# Altium project IPA-Safety-Relay-Board.PrjPcb
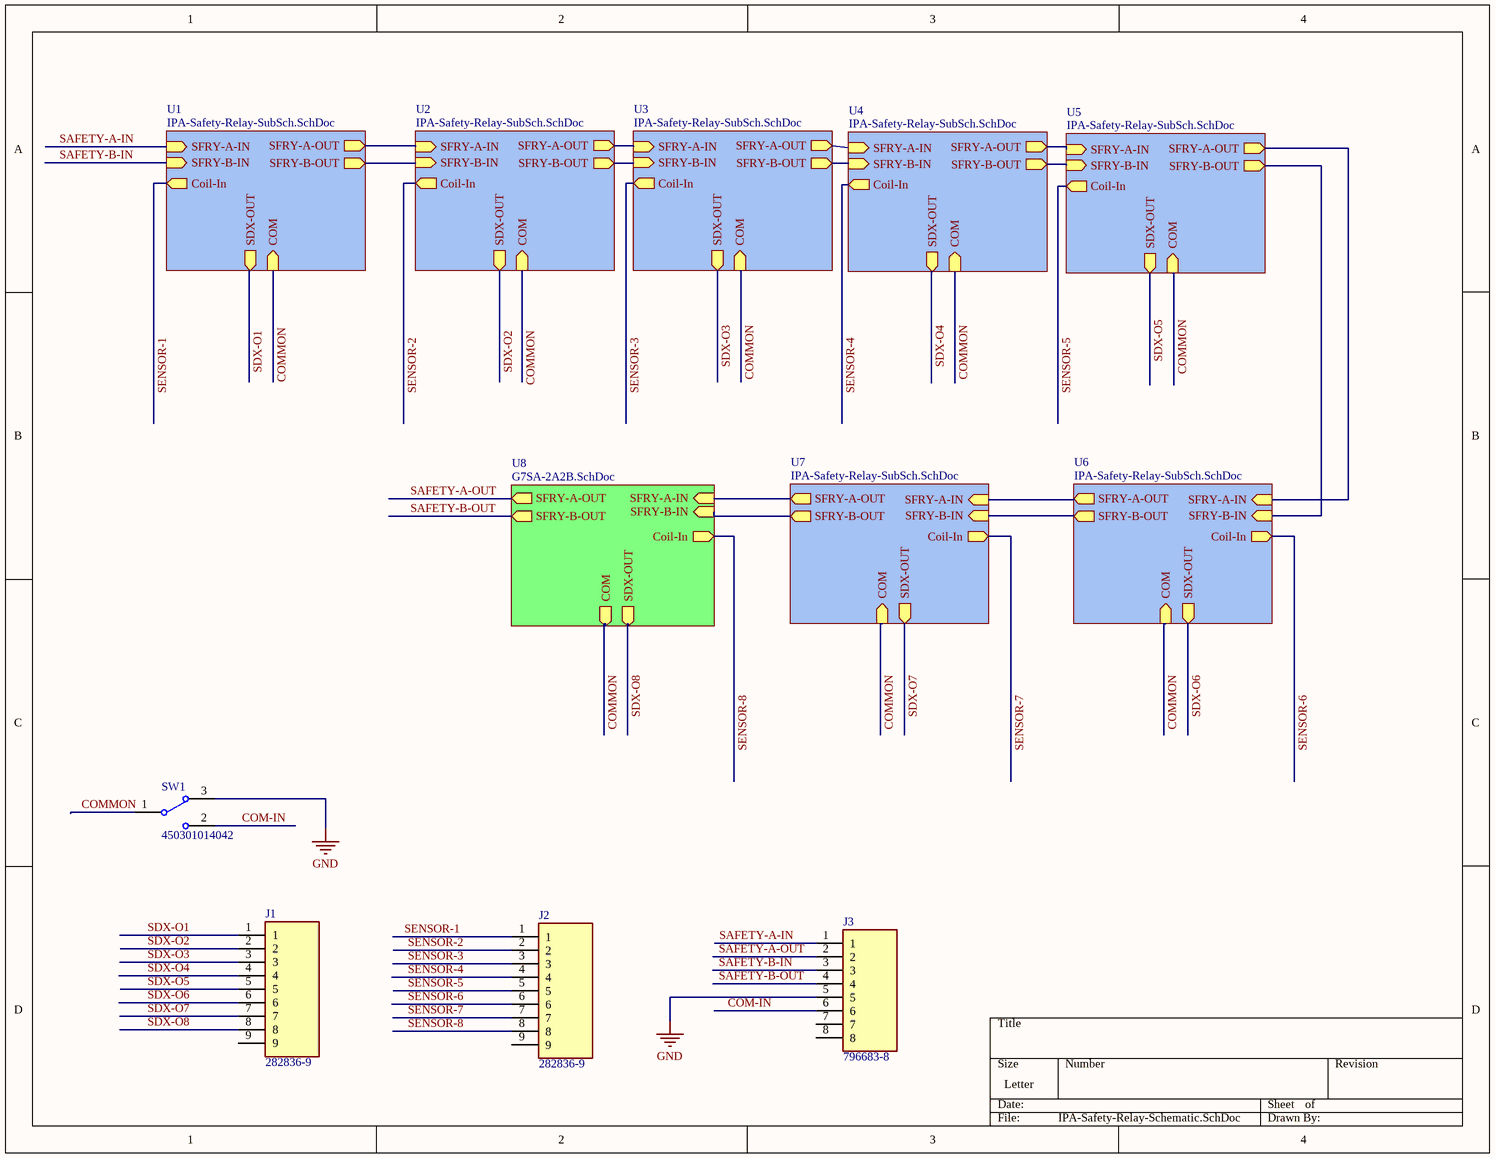
[diagram p0: IPA-Safety-Relay-Schematic.SchDoc]
3 sheets, 12 parts. Net scope: hierarchical (ports join the sheet entries above them; power ports are global).
Board file: IPA-Safety-Relay-PCB.PcbDoc
Sheets:
  IPA-Safety-Relay-Schematic.SchDoc
    U1 = IPA-Safety-Relay-SubSch.SchDoc
    U2 = IPA-Safety-Relay-SubSch.SchDoc
    U3 = IPA-Safety-Relay-SubSch.SchDoc
    U4 = IPA-Safety-Relay-SubSch.SchDoc
    U5 = IPA-Safety-Relay-SubSch.SchDoc
    U8 = G7SA-2A2B.SchDoc
    U6 = IPA-Safety-Relay-SubSch.SchDoc
    U7 = IPA-Safety-Relay-SubSch.SchDoc

## Sheet IPA-Safety-Relay-Schematic.SchDoc
size Letter

### Parts
J1  282836-9  [SHDR9W130P0X500_1X9_4500X820X1020P]
J2  282836-9  [SHDR9W130P0X500_1X9_4500X820X1020P]
J3  796683-8  [SHDR8W110P0X500_1X8_4000X900X1520P]
SW1  450301014042  [450301014042]

### Sub-sheets
U1 = IPA-Safety-Relay-SubSch.SchDoc: SFRY-A-IN (in), SFRY-B-IN (in), Coil-In (out), SFRY-A-OUT (out), SFRY-B-OUT (out), SDX-OUT (out), COM (in)
U2 = IPA-Safety-Relay-SubSch.SchDoc: SFRY-A-IN (in), SFRY-B-IN (in), Coil-In (out), SFRY-A-OUT (out), SFRY-B-OUT (out), SDX-OUT (out), COM (in)
U3 = IPA-Safety-Relay-SubSch.SchDoc: SFRY-A-IN (in), SFRY-B-IN (in), Coil-In (out), SFRY-A-OUT (out), SFRY-B-OUT (out), SDX-OUT (out), COM (in)
U4 = IPA-Safety-Relay-SubSch.SchDoc: SFRY-A-IN (in), SFRY-B-IN (in), Coil-In (out), SFRY-A-OUT (out), SFRY-B-OUT (out), SDX-OUT (out), COM (in)
U5 = IPA-Safety-Relay-SubSch.SchDoc: SFRY-A-IN (in), SFRY-B-IN (in), Coil-In (out), SFRY-A-OUT (out), SFRY-B-OUT (out), SDX-OUT (out), COM (in)
U6 = IPA-Safety-Relay-SubSch.SchDoc: SFRY-A-IN (in), SFRY-B-IN (in), Coil-In (out), SFRY-A-OUT (out), SFRY-B-OUT (out), SDX-OUT (out), COM (in)
U7 = IPA-Safety-Relay-SubSch.SchDoc: SFRY-A-IN (in), SFRY-B-IN (in), Coil-In (out), SFRY-A-OUT (out), SFRY-B-OUT (out), SDX-OUT (out), COM (in)
U8 = G7SA-2A2B.SchDoc: SFRY-B-IN (in), SFRY-B-OUT (out), SFRY-A-IN (in), SFRY-A-OUT (out), Coil-In (out), SDX-OUT (out), COM (out)

### Nets
GND: J3.5 SW1.3
COM-IN: J3.6 SW1.2
COMMON: SW1.1 ; sheet U1/COM, sheet U2/COM, sheet U3/COM, sheet U4/COM, sheet U5/COM, sheet U8/COM, sheet U6/COM, sheet U7/COM
SAFETY-A-IN: J3.1 ; sheet U1/SFRY-A-IN
SAFETY-A-OUT: J3.2 ; sheet U8/SFRY-A-OUT
SAFETY-B-IN: J3.3 ; sheet U1/SFRY-B-IN
SAFETY-B-OUT: J3.4 ; sheet U8/SFRY-B-OUT
SDX-O1: J1.1 ; sheet U1/SDX-OUT
SDX-O2: J1.2 ; sheet U2/SDX-OUT
SDX-O3: J1.3 ; sheet U3/SDX-OUT
SDX-O4: J1.4 ; sheet U4/SDX-OUT
SDX-O5: J1.5 ; sheet U5/SDX-OUT
SDX-O6: J1.6 ; sheet U6/SDX-OUT
SDX-O7: J1.7 ; sheet U7/SDX-OUT
SDX-O8: J1.8 ; sheet U8/SDX-OUT
SENSOR-1: J2.1 ; sheet U1/Coil-In
SENSOR-2: J2.2 ; sheet U2/Coil-In
SENSOR-3: J2.3 ; sheet U3/Coil-In
SENSOR-4: J2.4 ; sheet U4/Coil-In
SENSOR-5: J2.5 ; sheet U5/Coil-In
SENSOR-6: J2.6 ; sheet U6/Coil-In
SENSOR-7: J2.7 ; sheet U7/Coil-In
SENSOR-8: J2.8 ; sheet U8/Coil-In
NetK1_U1_5: sheet U1/SFRY-A-OUT, sheet U2/SFRY-A-IN
NetK1_U1_6: sheet U1/SFRY-B-OUT, sheet U2/SFRY-B-IN
NetK1_U2_5: sheet U2/SFRY-A-OUT, sheet U3/SFRY-A-IN
NetK1_U2_6: sheet U2/SFRY-B-OUT, sheet U3/SFRY-B-IN
NetK1_U3_5: sheet U3/SFRY-A-OUT, sheet U4/SFRY-A-IN
NetK1_U3_6: sheet U3/SFRY-B-OUT, sheet U4/SFRY-B-IN
NetK1_U4_5: sheet U4/SFRY-A-OUT, sheet U5/SFRY-A-IN
NetK1_U4_6: sheet U4/SFRY-B-OUT, sheet U5/SFRY-B-IN
NetK1_U5_5: sheet U5/SFRY-A-OUT, sheet U6/SFRY-A-IN
NetK1_U5_6: sheet U5/SFRY-B-OUT, sheet U6/SFRY-B-IN
NetK1_U6_5: sheet U6/SFRY-A-OUT, sheet U7/SFRY-A-IN
NetK1_U6_6: sheet U6/SFRY-B-OUT, sheet U7/SFRY-B-IN
NetK1_U7_5: sheet U8/SFRY-A-IN, sheet U7/SFRY-A-OUT
NetK1_U7_6: sheet U8/SFRY-B-IN, sheet U7/SFRY-B-OUT

Not connected (* = marked no-connect by the designer): J1 9; J2 9; J3 7 8

### Library data of the parts
J1 J2 = 282836-9: Connector; Manufacturer_Name: TE Connectivity; Allied_Number: 70285523; Datasheet Link: http://www.te.com/commerce/DocumentDelivery/DDEController?Action=srchrtrv&DocNm=282836&DocType=Customer+Drawing&DocLang=English; Height: 10.2mm; Manufacturer_Part_Number: 282836-9; Mouser Part Number: 571-282836-9; Mouser Price/Stock: https://www.mouser.com/Search/Refine.aspx?Keyword=571-282836-9; RS Part Number: 3617746; RS Price/Stock: http://uk.rs-online.com/web/p/products/3617746; Allied Price/Stock: https://www.alliedelec.com/te-connectivity-282836-9/70285523/
J3 = 796683-8: Connector; Manufacturer_Name: TE Connectivity; Datasheet Link: http://www.te.com/commerce/DocumentDelivery/DDEController?Action=srchrtrv&DocNm=796683&DocType=Customer+Drawing&DocLang=English; Height: 15.2mm; Manufacturer_Part_Number: 796683-8; Mouser Part Number: 571-796683-8; Mouser Price/Stock: https://www.mouser.com/Search/Refine.aspx?Keyword=571-796683-8
SW1 = CMP-1466-00001-1: WS-SLTV 10mm*2.5mm, SPDT, ON-ON, 2.54mm, straight type, THT, Mini Slide Switch, 3 pins; Manufacturer: Wuerth Elektronik; NoPins: 06; ComponentLink2URL: http://katalog.we-online.de/em/datasheet/450301014042.pdf; PartNumber: 450301014042; ComponentLink1Description: Manufacturer URL; ComponentLink2Description: Datasheet; PackageReference: 450301014042; ComponentLink1URL: http://www.we-online.com

## Sheet IPA-Safety-Relay-SubSch.SchDoc
size Letter
Used 7 times, as channels U1, U2, U3, U4, U5, U6, U7. Parts and nets are listed once, with the designators drawn on the sheet.
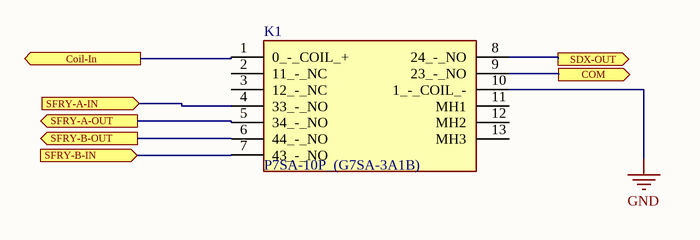
[diagram p1: IPA-Safety-Relay-SubSch.SchDoc]

### Parts
K1  P7SA-10P_(G7SA-3A1B)  [P7SA10PG7SA2A2B]

### Ports
Coil-In (out), COM (out), SDX-OUT (out), SFRY-A-IN (in), SFRY-A-OUT (out), SFRY-B-IN (in), SFRY-B-OUT (out)

### Nets
GND: K1.10(1_-_COIL_-)
Coil-In: K1.1(0_-_COIL_+) ; port Coil-In
COM: K1.9(23_-_NO) ; port COM
SDX-OUT: K1.8(24_-_NO) ; port SDX-OUT
SFRY-A-IN: K1.4(33_-_NO) ; port SFRY-A-IN
SFRY-A-OUT: K1.5(34_-_NO) ; port SFRY-A-OUT
SFRY-B-IN: K1.7(43_-_NO) ; port SFRY-B-IN
SFRY-B-OUT: K1.6(44_-_NO) ; port SFRY-B-OUT

Not connected (* = marked no-connect by the designer): K1 2(11_-_NC) 3(12_-_NC) 11(MH1) 12(MH2) 13(MH3)

### Channels
U1: designators end in _U1; ports Coil-In=SENSOR-1 COM=COMMON SDX-OUT=SDX-O1 SFRY-A-IN=SAFETY-A-IN SFRY-A-OUT=NetK1_U1_5 SFRY-B-IN=SAFETY-B-IN SFRY-B-OUT=NetK1_U1_6
U2: designators end in _U2; ports Coil-In=SENSOR-2 COM=COMMON SDX-OUT=SDX-O2 SFRY-A-IN=NetK1_U1_5 SFRY-A-OUT=NetK1_U2_5 SFRY-B-IN=NetK1_U1_6 SFRY-B-OUT=NetK1_U2_6
U3: designators end in _U3; ports Coil-In=SENSOR-3 COM=COMMON SDX-OUT=SDX-O3 SFRY-A-IN=NetK1_U2_5 SFRY-A-OUT=NetK1_U3_5 SFRY-B-IN=NetK1_U2_6 SFRY-B-OUT=NetK1_U3_6
U4: designators end in _U4; ports Coil-In=SENSOR-4 COM=COMMON SDX-OUT=SDX-O4 SFRY-A-IN=NetK1_U3_5 SFRY-A-OUT=NetK1_U4_5 SFRY-B-IN=NetK1_U3_6 SFRY-B-OUT=NetK1_U4_6
U5: designators end in _U5; ports Coil-In=SENSOR-5 COM=COMMON SDX-OUT=SDX-O5 SFRY-A-IN=NetK1_U4_5 SFRY-A-OUT=NetK1_U5_5 SFRY-B-IN=NetK1_U4_6 SFRY-B-OUT=NetK1_U5_6
U6: designators end in _U6; ports Coil-In=SENSOR-6 COM=COMMON SDX-OUT=SDX-O6 SFRY-A-IN=NetK1_U5_5 SFRY-A-OUT=NetK1_U6_5 SFRY-B-IN=NetK1_U5_6 SFRY-B-OUT=NetK1_U6_6
U7: designators end in _U7; ports Coil-In=SENSOR-7 COM=COMMON SDX-OUT=SDX-O7 SFRY-A-IN=NetK1_U6_5 SFRY-A-OUT=NetK1_U7_5 SFRY-B-IN=NetK1_U6_6 SFRY-B-OUT=NetK1_U7_6

### Library data of the parts
K1 = P7SA-10P_(G7SA-3A1B): Relay or Contactor; Manufacturer_Name: Omron Electronics; Manufacturer_Part_Number: P7SA-10P (G7SA-3A1B); Allied_Number: 70033653; Datasheet Link: http://www.ia.omron.com/data_pdf/cat/g7sa_j120-e1_12_1_csm1269.pdf; Mouser Part Number: 653-P7SA-10P; Mouser Price/Stock: https://www.mouser.com/Search/Refine.aspx?Keyword=653-P7SA-10P; Allied Price/Stock: https://www.alliedelec.com/omron-safety-sti-p7sa-10p/70033653/

## Sheet G7SA-2A2B.SchDoc
size A
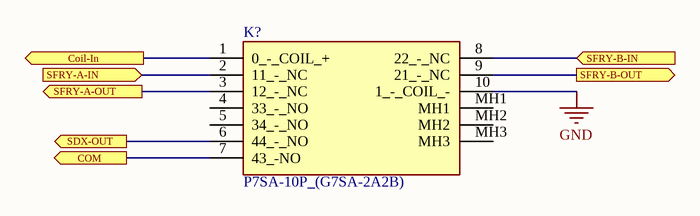
[diagram p2: G7SA-2A2B.SchDoc]

### Parts
K1_U8  P7SA-10P_(G7SA-2A2B)  [P7SA10PG7SA2A2B]

### Ports
Coil-In (out), COM (out), SDX-OUT (out), SFRY-A-IN (in), SFRY-A-OUT (out), SFRY-B-IN (in), SFRY-B-OUT (out)

### Nets
GND: K1_U8.10(1_-_COIL_-)
COMMON: K1_U8.7(43_-NO) ; port COM
SAFETY-A-OUT: K1_U8.3(12_-_NC) ; port SFRY-A-OUT
SAFETY-B-OUT: K1_U8.9(21_-_NC) ; port SFRY-B-OUT
SDX-O8: K1_U8.6(44_-_NO) ; port SDX-OUT
SENSOR-8: K1_U8.1(0_-_COIL_+) ; port Coil-In
NetK1_U7_5: K1_U8.2(11_-_NC) ; port SFRY-A-IN
NetK1_U7_6: K1_U8.8(22_-_NC) ; port SFRY-B-IN

Not connected (* = marked no-connect by the designer): K1_U8 4(33_-_NO) 5(34_-_NO) MH1 MH2 MH3

### Library data of the parts
K1_U8 = P7SA-10P_(G7SA-2A2B): Relay or Contactor; Manufacturer_Name: Omron Electronics; Manufacturer_Part_Number: P7SA-10P (G7SA-2A2B); Datasheet Link: http://www.ia.omron.com/data_pdf/cat/g7sa_j120-e1_12_1_csm1269.pdf

## Nets that join several sheets
GND: IPA-Safety-Relay-Schematic (J3.5 SW1.3), U1 (K1_U1.10), U2 (K1_U2.10), U3 (K1_U3.10), U4 (K1_U4.10), U5 (K1_U5.10), G7SA-2A2B (K1_U8.10), U6 (K1_U6.10), U7 (K1_U7.10)
COMMON: IPA-Safety-Relay-Schematic (SW1.1), U1 (K1_U1.9), U2 (K1_U2.9), U3 (K1_U3.9), U4 (K1_U4.9), U5 (K1_U5.9), G7SA-2A2B (K1_U8.7), U6 (K1_U6.9), U7 (K1_U7.9)
NetK1_U1_5: U1 (K1_U1.5), U2 (K1_U2.4)
NetK1_U1_6: U1 (K1_U1.6), U2 (K1_U2.7)
NetK1_U2_5: U2 (K1_U2.5), U3 (K1_U3.4)
NetK1_U2_6: U2 (K1_U2.6), U3 (K1_U3.7)
NetK1_U3_5: U3 (K1_U3.5), U4 (K1_U4.4)
NetK1_U3_6: U3 (K1_U3.6), U4 (K1_U4.7)
NetK1_U4_5: U4 (K1_U4.5), U5 (K1_U5.4)
NetK1_U4_6: U4 (K1_U4.6), U5 (K1_U5.7)
NetK1_U5_5: U5 (K1_U5.5), U6 (K1_U6.4)
NetK1_U5_6: U5 (K1_U5.6), U6 (K1_U6.7)
NetK1_U6_5: U6 (K1_U6.5), U7 (K1_U7.4)
NetK1_U6_6: U6 (K1_U6.6), U7 (K1_U7.7)
NetK1_U7_5: G7SA-2A2B (K1_U8.2), U7 (K1_U7.5)
NetK1_U7_6: G7SA-2A2B (K1_U8.8), U7 (K1_U7.6)
SAFETY-A-IN: IPA-Safety-Relay-Schematic (J3.1), U1 (K1_U1.4)
SAFETY-A-OUT: IPA-Safety-Relay-Schematic (J3.2), G7SA-2A2B (K1_U8.3)
SAFETY-B-IN: IPA-Safety-Relay-Schematic (J3.3), U1 (K1_U1.7)
SAFETY-B-OUT: IPA-Safety-Relay-Schematic (J3.4), G7SA-2A2B (K1_U8.9)
SDX-O1: IPA-Safety-Relay-Schematic (J1.1), U1 (K1_U1.8)
SDX-O2: IPA-Safety-Relay-Schematic (J1.2), U2 (K1_U2.8)
SDX-O3: IPA-Safety-Relay-Schematic (J1.3), U3 (K1_U3.8)
SDX-O4: IPA-Safety-Relay-Schematic (J1.4), U4 (K1_U4.8)
SDX-O5: IPA-Safety-Relay-Schematic (J1.5), U5 (K1_U5.8)
SDX-O6: IPA-Safety-Relay-Schematic (J1.6), U6 (K1_U6.8)
SDX-O7: IPA-Safety-Relay-Schematic (J1.7), U7 (K1_U7.8)
SDX-O8: IPA-Safety-Relay-Schematic (J1.8), G7SA-2A2B (K1_U8.6)
SENSOR-1: IPA-Safety-Relay-Schematic (J2.1), U1 (K1_U1.1)
SENSOR-2: IPA-Safety-Relay-Schematic (J2.2), U2 (K1_U2.1)
SENSOR-3: IPA-Safety-Relay-Schematic (J2.3), U3 (K1_U3.1)
SENSOR-4: IPA-Safety-Relay-Schematic (J2.4), U4 (K1_U4.1)
SENSOR-5: IPA-Safety-Relay-Schematic (J2.5), U5 (K1_U5.1)
SENSOR-6: IPA-Safety-Relay-Schematic (J2.6), U6 (K1_U6.1)
SENSOR-7: IPA-Safety-Relay-Schematic (J2.7), U7 (K1_U7.1)
SENSOR-8: IPA-Safety-Relay-Schematic (J2.8), G7SA-2A2B (K1_U8.1)